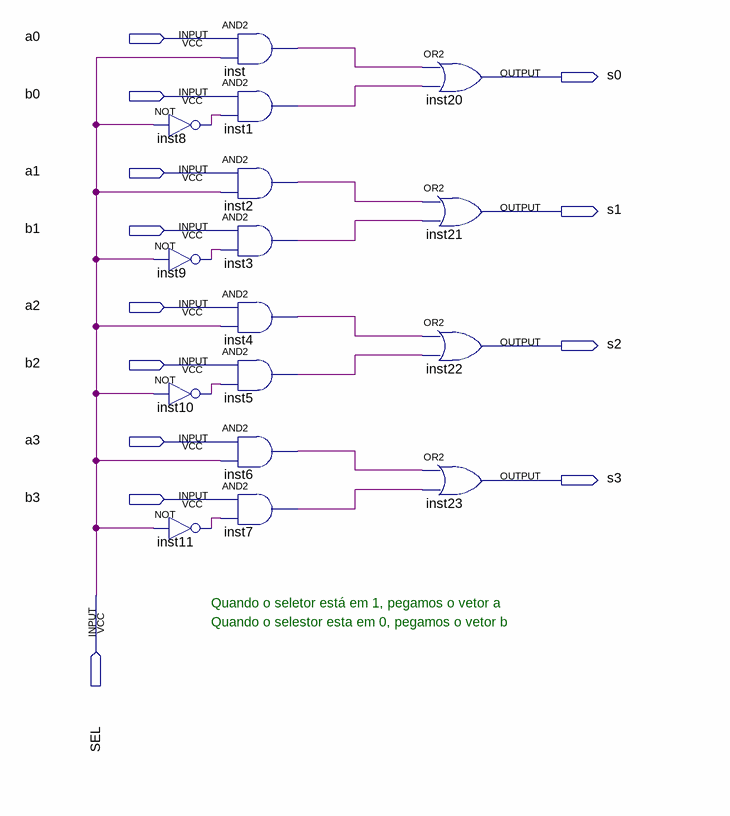
[diagram p0: schematic sheet]
// Quartus schematic SeletorComplemento.bdf as structural Verilog: 16 symbols, 13 pins
module SeletorComplemento (
  input  a0,
  input  b0,
  input  a1,
  input  b1,
  input  a2,
  input  b2,
  input  a3,
  input  b3,
  input  SEL,
  output s0,
  output s1,
  output s2,
  output s3
);

  wire inst1_out, inst2_out, inst3_out, inst4_out, inst5_out, inst6_out, inst7_out, inst8_out, inst9_out,
       inst10_out, inst11_out, inst_out;

  not inst8 (inst8_out, SEL);
  not inst9 (inst9_out, SEL);
  not inst10 (inst10_out, SEL);
  not inst11 (inst11_out, SEL);
  and inst (inst_out, a0, SEL);
  and inst1 (inst1_out, b0, inst8_out);
  and inst2 (inst2_out, a1, SEL);
  and inst3 (inst3_out, b1, inst9_out);
  and inst4 (inst4_out, a2, SEL);
  and inst5 (inst5_out, b2, inst10_out);
  and inst6 (inst6_out, a3, SEL);
  and inst7 (inst7_out, b3, inst11_out);
  or inst20 (s0, inst_out, inst1_out);
  or inst21 (s1, inst2_out, inst3_out);
  or inst22 (s2, inst4_out, inst5_out);
  or inst23 (s3, inst6_out, inst7_out);

  // Notes on the sheet:
  //   Quando o seletor está em 1, pegamos o vetor a
  //   Quando o selestor esta em 0, pegamos o vetor b
endmodule
